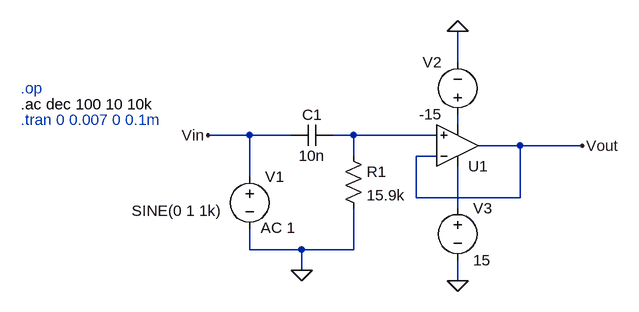
[diagram p0: schematic Active 1st order HPF.asc]
Active 1st order HPF.asc, the LTspice schematic file:
Version 4.1
SHEET 1 880 680
WIRE 256 16 256 -32
WIRE 256 112 256 96
WIRE -64 128 -128 128
WIRE 0 128 -64 128
WIRE 96 128 64 128
WIRE 224 128 96 128
WIRE 352 144 288 144
WIRE 448 144 352 144
WIRE 96 160 96 128
WIRE 224 160 192 160
WIRE -64 192 -64 128
WIRE 192 224 192 160
WIRE 352 224 352 144
WIRE 352 224 192 224
WIRE 256 240 256 176
WIRE -64 304 -64 272
WIRE 16 304 -64 304
WIRE 96 304 96 240
WIRE 96 304 16 304
WIRE 16 336 16 304
WIRE 256 352 256 320
FLAG -128 128 Vin
FLAG 16 336 0
FLAG 448 144 Vout
FLAG 256 352 0
FLAG 256 -32 0
SYMBOL res 80 144 R0
SYMATTR InstName R1
SYMATTR Value 15.9k
SYMBOL cap 64 112 R90
WINDOW 0 0 32 VBottom 2
WINDOW 3 32 32 VTop 2
SYMATTR InstName C1
SYMATTR Value 10n
SYMBOL voltage -64 176 R0
WINDOW 3 -181 68 Left 2
WINDOW 123 17 94 Left 2
WINDOW 39 0 0 Left 0
SYMATTR Value SINE(0 1 1k)
SYMATTR Value2 AC 1
SYMATTR InstName V1
SYMBOL OpAmps\\UniversalOpAmp2 256 144 M180
SYMATTR InstName U1
SYMBOL voltage 256 112 R180
WINDOW 0 24 96 Left 2
WINDOW 3 24 16 Left 2
WINDOW 123 0 0 Left 0
WINDOW 39 0 0 Left 0
SYMATTR InstName V2
SYMATTR Value -15
SYMBOL voltage 256 224 R0
WINDOW 123 0 0 Left 0
WINDOW 39 0 0 Left 0
SYMATTR InstName V3
SYMATTR Value 15
TEXT -416 56 Left 2 ;.op
TEXT -416 80 Left 2 !.ac dec 100 10 10k
TEXT -416 104 Left 2 ;.tran 0 0.007 0 0.1m

The netlist it stands for:
* Active 1st order HPF.asc
R1 N002 0 15.9k
C1 N002 Vin 10n
V1 Vin 0 SINE(0 1 1k) AC 1
X§U1 N002 Vout N003 N001 Vout level2 Avol=1Meg GBW=10Meg Slew=10Meg Ilimit=25m Rail=0 Vos=0 En=0 Enk=0 In=0 Ink=0 Rin=500Meg  ; pins In+ In- V+ V- OUT
V2 N001 0 -15
V3 N003 0 15
* .op
.ac dec 100 10 10k
* .tran 0 0.007 0 0.1m
.lib UniversalOpAmp2.lib
.backanno
.end